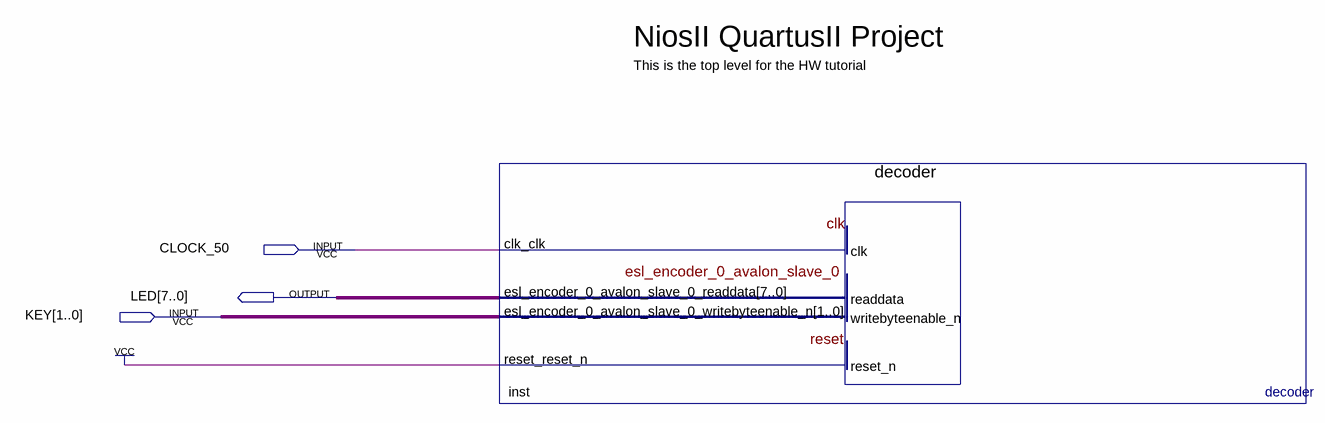
[diagram p0: schematic sheet]
// Quartus schematic nios2_quartus2_project.bdf as structural Verilog: 1 symbols, 3 pins
module nios2_quartus2_project (
  input  CLOCK_50,
  input  [1:0] KEY,
  output [7:0] LED
);

  decoder inst (
    .clk_clk(CLOCK_50), .esl_encoder_0_avalon_slave_0_writebyteenable_n(KEY), .reset_reset_n(1'b1),
    .esl_encoder_0_avalon_slave_0_readdata(LED));

  // Notes on the sheet:
  //   NiosII QuartusII Project
  //   This is the top level for the HW tutorial
endmodule
